# EAGLE design drownAlert_try1 (EAGLE 9.4.0)
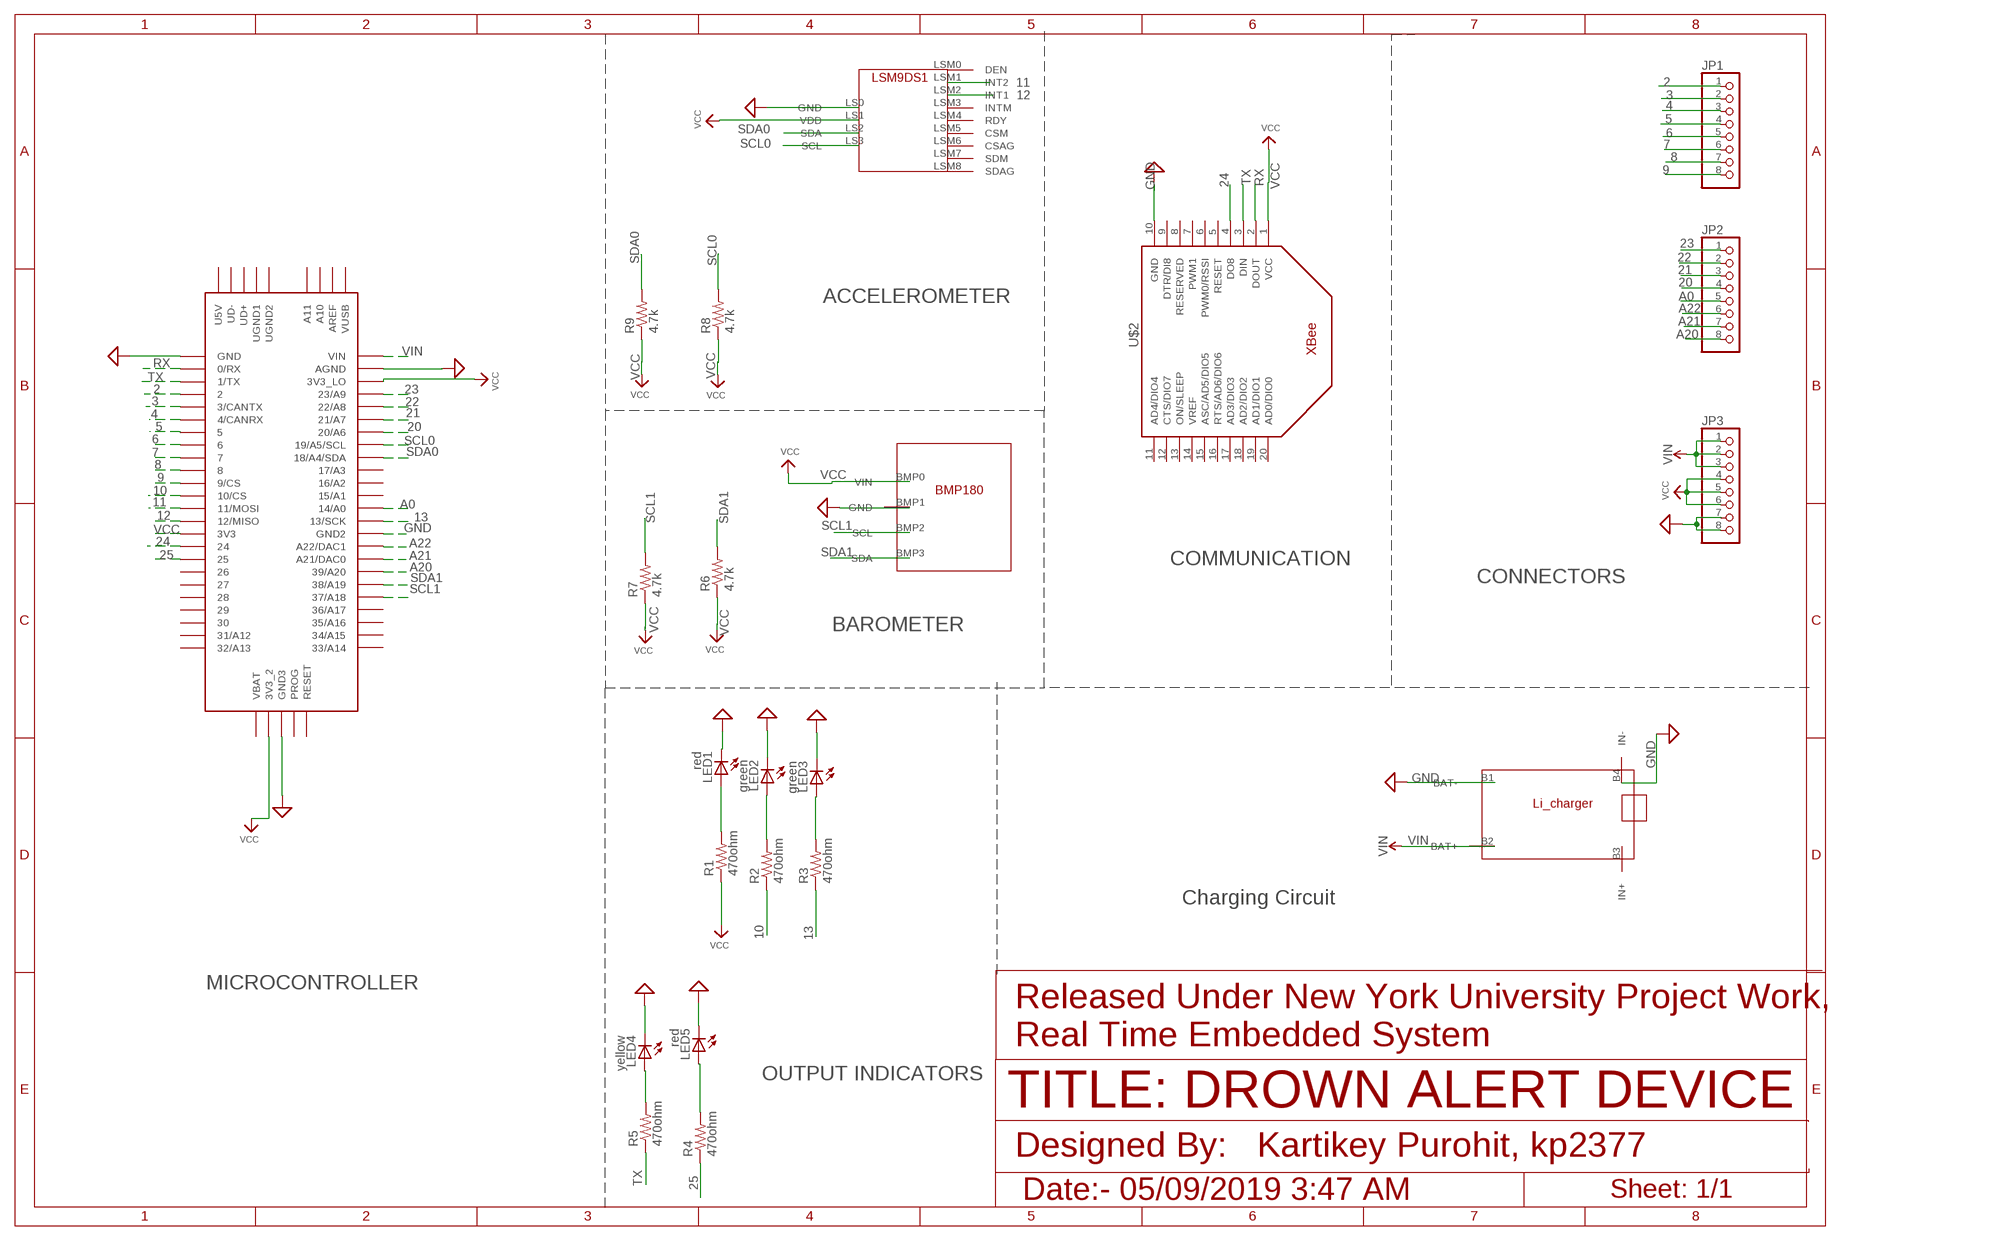
[diagram p0: schematic, sheet 1]

## Parts
JP1  PINHD-1X8-3.5MM  [1X08-3.5MM]
JP2  PINHD-1X8-3.5MM  [1X08-3.5MM]
JP3  PINHD-1X8-3.5MM  [1X08-3.5MM]
LED1  red  LEDCHIPLED_1206  [CHIPLED_1206]
LED2  green  LEDCHIPLED_1206  [CHIPLED_1206]
LED3  green  LEDCHIPLED_1206  [CHIPLED_1206]
LED4  yellow  LEDCHIPLED_1206  [CHIPLED_1206]
LED5  red  LEDCHIPLED_1206  [CHIPLED_1206]
R1  470ohm  R-US_R1206  [R1206]
R2  470ohm  R-US_R1206  [R1206]
R3  470ohm  R-US_R1206  [R1206]
R4  470ohm  R-US_R1206  [R1206]
R5  470ohm  R-US_R1206  [R1206]
R6  4.7k  R-US_R1206  [R1206]
R7  4.7k  R-US_R1206  [R1206]
R8  4.7k  R-US_R1206  [R1206]
R9  4.7k  R-US_R1206  [R1206]
U$1  TEENSY_3.5/3.6  [TEENSY_3.5/3.6]
U$2  XBEE  [XBEE]
U$3  KKP_BATTERY_CHARGER  [KKP_CUSTOM_BATTERY_CHARGER]
U$5  KKP_BMP180  [KKP_CUSTOM_BMP180]
U$6  KKP_LSM  [KKP_CUSTOM_LSM9D-S1_FOOTPRINT]

## Nets
2: JP1.1 U$1.2
3: JP1.2 U$1.3/CANTX
4: JP1.3 U$1.4/CANRX
5: JP1.4 U$1.5
6: JP1.5 U$1.6
7: JP1.6 U$1.7
8: JP1.7 U$1.8
9: JP1.8 U$1.9/CS
10: R2.1 U$1.10/CS
11: U$1.11/MOSI U$6.LSM1(INT2)
12: U$1.12/MISO U$6.LSM2(INT1)
13: R3.1 U$1.13/SCK
20: JP2.4 U$1.20/A6
21: JP2.3 U$1.21/A7
22: JP2.2 U$1.22/A8
23: JP2.1 U$1.23/A9
24: U$1.24 U$2.4(DO8)
25: R4.1 U$1.25
A0: JP2.5 U$1.14/A0
A20: JP2.8 U$1.39/A20
A21: JP2.7 U$1.21/DAC0(A21/DAC0)
A22: JP2.6 U$1.A22/DAC1
GND: JP3.7 JP3.8 LED1.C LED2.C LED3.C LED4.C LED5.C U$1.AGND U$1.GND U$1.GND2 U$1.GND3 U$2.10(GND) U$3.B1(BAT-) U$3.B4(IN-) U$5.BMP1(GND) U$6.LS0(GND) ; supply symbol labelled SUP
N$1: LED1.A R1.2
N$2: LED2.A R2.2
N$3: LED3.A R3.2
N$32: LED4.A R5.2
N$33: LED5.A R4.2
RX: U$1.0/RX U$2.2(DOUT)
SCL0: R8.2 U$1.19/A5/SCL U$6.LS3(SCL)
SCL1: R7.2 U$1.37/A18 U$5.BMP2(SCL)
SDA0: R9.2 U$1.18/A4/SDA U$6.LS2(SDA)
SDA1: R6.2 U$1.38/A19 U$5.BMP3(SDA)
TX: R5.1 U$1.1/TX U$2.3(DIN)
VCC: JP3.4 JP3.5 JP3.6 R1.1 R6.1 R7.1 R8.1 R9.1 U$1.3V3 U$1.3V3_2 U$1.3V3_LO U$2.1(VCC) U$5.BMP0(VIN) U$6.LS1(VDD)
VIN: JP3.1 JP3.2 JP3.3 U$1.VIN U$3.B2(BAT+)
Unconnected: U$1.15/A1 U$1.16/A2 U$1.17/A3 U$1.26 U$1.27 U$1.28 U$1.29 U$1.30 U$1.31/A12 U$1.32/A13 U$1.33/A14 U$1.34/A15 U$1.35/A16 U$1.36/A17 U$1.A10 U$1.A11 U$1.AREF U$1.PROG U$1.RESET U$1.U5V U$1.UD+ U$1.UD- U$1.UGND1 U$1.UGND2 U$1.VBAT U$1.VUSB U$2.5(RESET) U$2.6(PWM0/RSSI) U$2.7(PWM1) U$2.8(RESERVED) U$2.9(DTR/DI8) U$2.11(AD4/DIO4) U$2.12(CTS/DIO7) U$2.13(ON/SLEEP) U$2.14(VREF) U$2.15(ASC/AD5/DIO5) U$2.16(RTS/AD6/DIO6) U$2.17(AD3/DIO3) U$2.18(AD2/DIO2) U$2.19(AD1/DIO1) U$2.20(AD0/DIO0) U$3.B3(IN+) U$6.LSM0(DEN) U$6.LSM3(INTM) U$6.LSM4(RDY) U$6.LSM5(CSM) U$6.LSM6(CSAG) U$6.LSM7(SDM) U$6.LSM8(SDAG)

## Notes on the sheet
- ACCELEROMETER
- COMMUNICATION
- CONNECTORS
- BAROMETER
- Charging Circuit
- MICROCONTROLLER
- Released Under New York University Project Work, 
  Real Time Embedded System
- OUTPUT INDICATORS
- TITLE: DROWN ALERT DEVICE
- Designed By:   Kartikey Purohit, kp2377
- Date:- 05/09/2019 3:47 AM | Sheet: 1/1

## Library data of the parts
JP1-JP3 = adafruit:PINHD-1X8: PIN HEADER
LED1-LED5 = adafruit:LED: LED OSRAM: - CHIPLED LG R971, LG N971, LY N971, LG Q971, LY Q971, LO R971, LY R971 LH N974, LH R974 LS Q976, LO Q976, LY Q976 LO Q996 - Hyper CHIPLED LW Q18S LB Q993, LB Q99A, LB R99A - SideLED LS A670, LO A670, LY A670, LG A670, LP A670 LB A673, LV A673, LT A673, LW A673 LH A674 LY A675 LS A676, LA A676, LO A676, LY A676, LW A676 LS A679, LY A679, LG A679 - Hyper Micro SIDELED® LS Y876, LA Y876, LO Y876, LY Y876 LT Y87S - SmartLED LW L88C, LW L88S LB L89C, LB L89S, LG L890 LS L89K, LO L89K, LY L89K LS L896, LA L896, LO L896, LY L896 - TOPLED LS T670, LO T670, LY T670, LG T670, LP T670 LSG T670, LSP T670, LSY T670, LOP T670, LYG T670 LG T671, LOG T671, LSG T671 LB T673, LV T673, LT T673, LW T673 LH T674 LS T676, LA T676, LO T676, LY T676, LB T676, LH T676, LSB T676, LW T676 LB T67C, LV T67C, LT T67C, LS T67K, LO T67K, LY T67K, LW E67C LS E67B, LA E67B, LO E67B, LY E67B, LB E67C, LV E67C, LT E67C LW T67C LS T679, LY T679, LG T679 LS T770, LO T770, LY T770, LG T770, LP T770 LB T773, LV T773, LT T773, LW T773 LH T774 LS E675, LA E675, LY E675, LS T675 LS T776, LA T776, LO T776, LY T776, LB T776 LHGB T686 LT T68C, LB T68C - Hyper Mini TOPLED® LB M676 - Mini TOPLED Santana® LG M470 LS M47K, LO M47K, LY M47K Source: http://www.osram.convergy.de/
R1-R9 = adafruit:R-US_: RESISTOR, American symbol
U$1 = Teensy356:TEENSY_3.5/3.6
U$2 = adafruit:XBEE
U$3 = kkp_lsm:KKP_BATTERY_CHARGER
U$5 = kkp_lsm:KKP_BMP180
U$6 = kkp_lsm:KKP_LSM

## Board
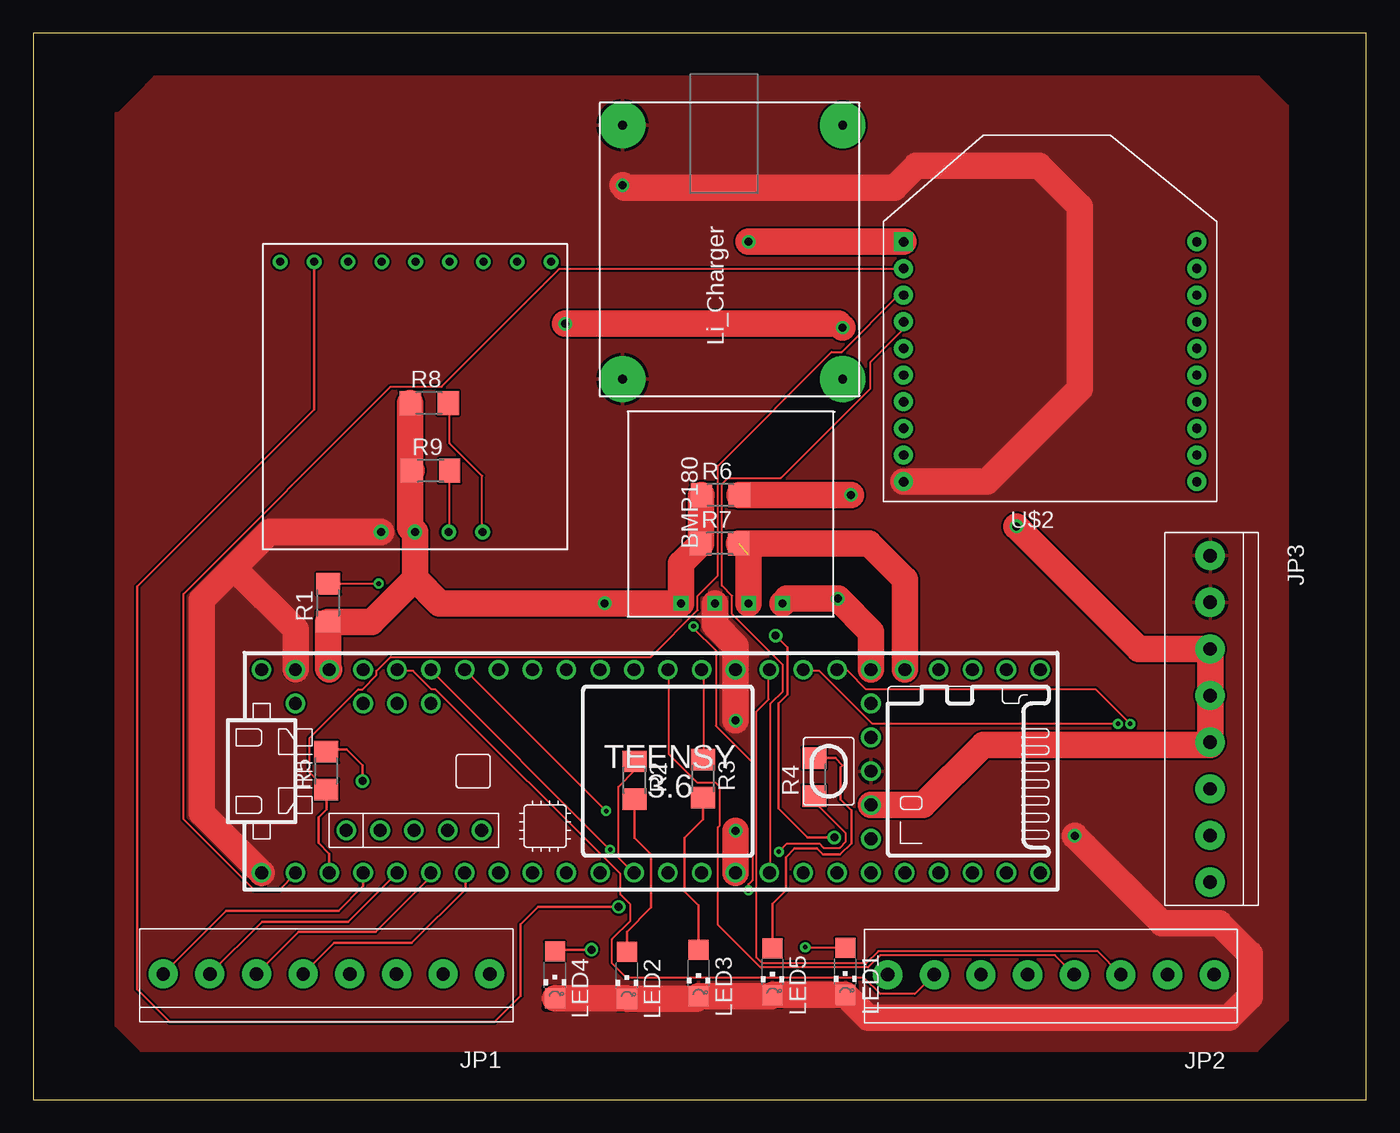
[diagram p1: board, top side]
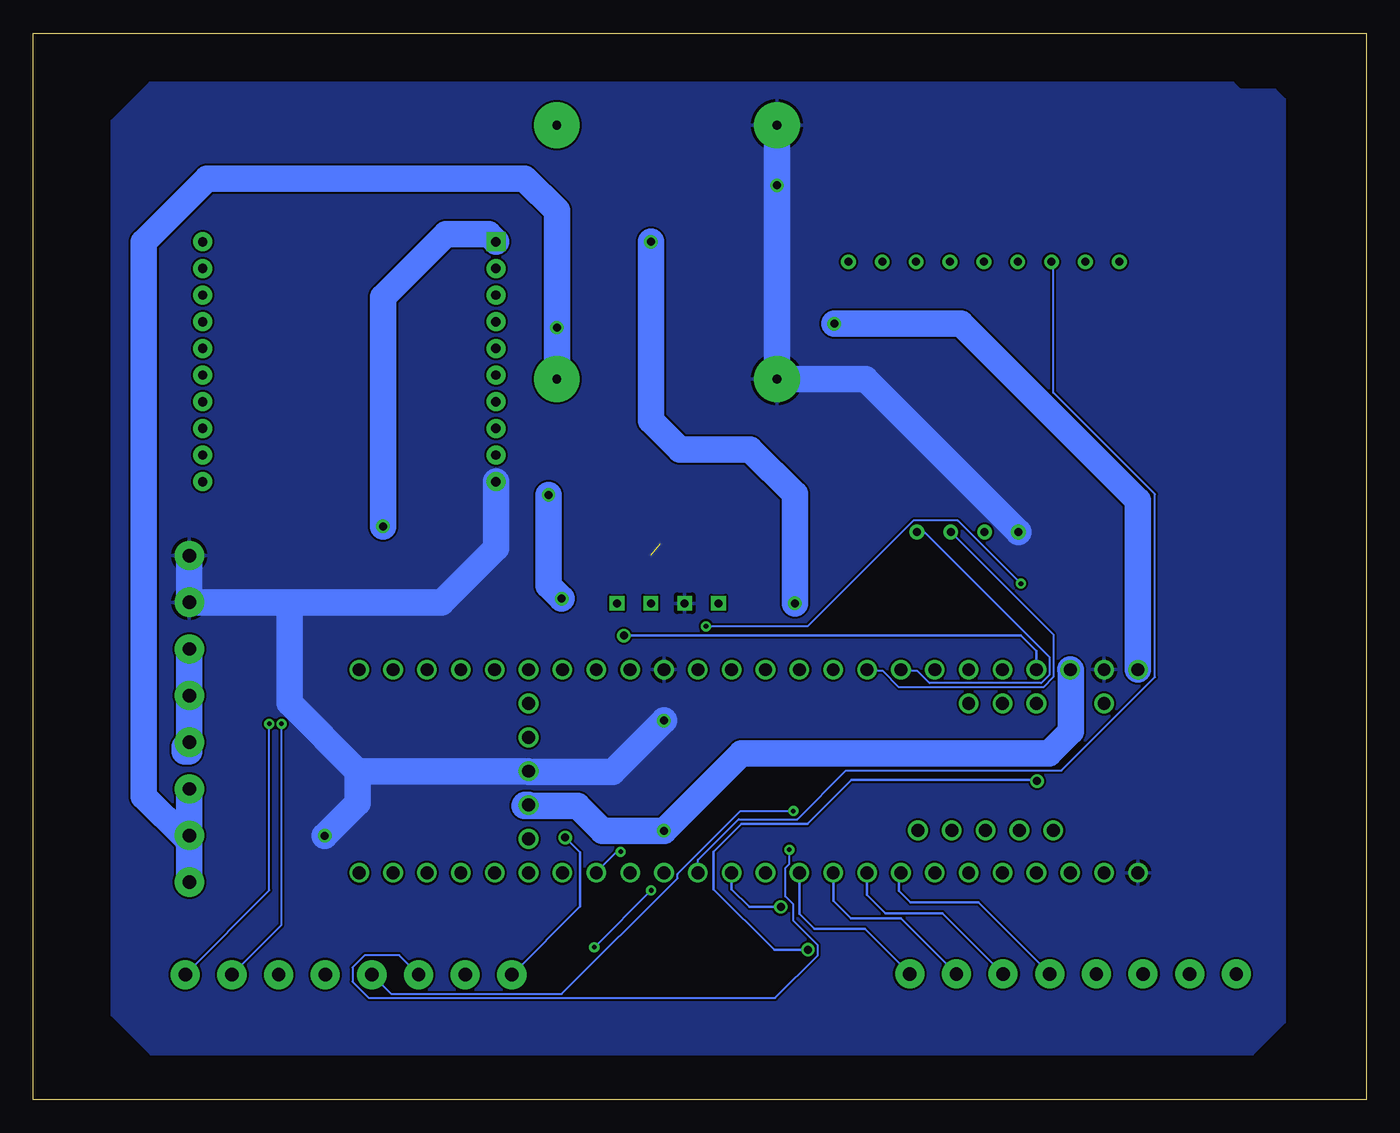
[diagram p2: board, bottom side, seen from below]

Size 100 x 80 mm. Coordinates in mm from the lower left corner, seen from the top.
Outline: 0,0 100,0 100,80 0,80 0,0
Copper layers (1*16): Top 0.035mm / dielectric 1.5mm / Bottom 0.035mm
Design rules "default": minimum track width 6mil, minimum drill 0.35mm, track to track 6mil, track to pad 6mil, pad to pad 6mil, via to via 6mil, smd to smd 6mil, copper to edge 40mil, drill to drill 6mil, minimum pad ring 10mil, minimum via ring 8mil, stop-mask expansion 4mil, vias tented up to drill 0mil, thermal gap 10mil

### Footprints (pad centres in the part's own frame; a part is rotated, then mirrored left to right if it is on the bottom)
1X08-3.5MM = drill 1 pad 2.184: 1 -12.25,0; 2 -8.75,0; 3 -5.25,0; 4 -1.75,0; 5 1.75,0; 6 5.25,0; 7 8.75,0; 8 12.25,0
CHIPLED_1206 = smd 1.5 x 1.5: A 0,-1.75; C 0,1.75
R1206 = smd 1.6 x 1.803: 1 -1.422,0; 2 1.422,0
TEENSY_3.5/3.6 = drill 0.965: 0/RX -25.4,-7.62; 1/TX -22.86,-7.62; 2 -20.32,-7.62; 3/CANTX -17.78,-7.62; 3V3 7.62,-7.62; 3V3_2 17.78,-2.54; 3V3_LO -22.86,7.62; 4/CANRX -15.24,-7.62; 5 -12.7,-7.62; 6 -10.16,-7.62; 7 -7.62,-7.62; 8 -5.08,-7.62; 9/CS -2.54,-7.62; 10/CS 0,-7.62; 11/MOSI 2.54,-7.62; 12/MISO 5.08,-7.62; 13/SCK 5.08,7.62; 14/A0 2.54,7.62; 15/A1 0,7.62; 16/A2 -2.54,7.62; 17/A3 -5.08,7.62; 18/A4/SDA -7.62,7.62; 19/A5/SCL -10.16,7.62; 20/A6 -12.7,7.62; 21/A7 -15.24,7.62; 21/DAC0 12.7,7.62; 22/A8 -17.78,7.62; 23/A9 -20.32,7.62; 24 10.16,-7.62; 25 12.7,-7.62; 26 15.24,-7.62; 27 17.78,-7.62; 28 20.32,-7.62; 29 22.86,-7.62; 30 25.4,-7.62; 31/A12 27.94,-7.62; 32/A13 30.48,-7.62; 33/A14 30.48,7.62; 34/A15 27.94,7.62; 35/A16 25.4,7.62; 36/A17 22.86,7.62; 37/A18 20.32,7.62; 38/A19 17.78,7.62; 39/A20 15.24,7.62; A10 -17.78,5.08; A11 -15.24,5.08; A22/DAC1 10.16,7.62; AGND -25.4,7.62; AREF -20.32,5.08; GND -27.94,-7.62; GND2 7.62,7.62; GND3 17.78,0; PROG 17.78,2.54; RESET 17.78,5.08; U5V -21.59,-4.445; UD+ -16.51,-4.445; UD- -19.05,-4.445; UGND1 -13.97,-4.445; UGND2 -11.43,-4.445; VBAT 17.78,-5.08; VIN -27.94,7.62; VUSB -25.4,5.08
XBEE = drill 0.7 pad 1.422 square: 1 -11,5.5 | drill 0.7 pad 1.422: 2 -11,3.5; 3 -11,1.5; 4 -11,-0.5; 5 -11,-2.5; 6 -11,-4.5; 7 -11,-6.5; 8 -11,-8.5; 9 -11,-10.5; 10 -11,-12.5; 11 11,-12.5; 12 11,-10.5; 13 11,-8.5; 14 11,-6.5; 15 11,-4.5; 16 11,-2.5; 17 11,-0.5; 18 11,1.5; 19 11,3.5; 20 11,5.5
KKP_CUSTOM_BATTERY_CHARGER = drill 0.65 pad 3.422: B1 1.27,17.78; B2 1.27,1.27; B3 20.32,1.27; B4 20.32,17.78
KKP_CUSTOM_BMP180 = drill 0.6 square: BMP0 0.98,11.46; BMP1 0.98,8.92; BMP2 0.98,6.38; BMP3 0.98,3.84
KKP_CUSTOM_LSM9D-S1_FOOTPRINT = drill 0.6: LS0 1.27,13.98; LS1 1.27,11.44; LS2 1.27,8.9; LS3 1.27,6.36; LSM0 21.55,21.54; LSM1 21.55,19; LSM2 21.55,16.46; LSM3 21.55,13.92; LSM4 21.55,11.38; LSM5 21.55,8.84; LSM6 21.55,6.3; LSM7 21.55,3.76; LSM8 21.55,1.22

### Placement (x,y rotation side)
JP1  21.99,9.42 0 top
JP2  76.35,9.37 0 top
JP3  88.29,28.56 90 top
LED1  60.92,9.62 180 top
LED2  44.53,9.32 180 top
LED3  49.91,9.48 180 top
LED4  39.13,9.36 180 top
LED5  55.46,9.58 180 top
R1  22.12,37.27 90 top
R2  45.11,23.95 270 top
R3  50.25,24.08 270 top
R4  58.6,24.2 90 top
R5  21.97,24.67 90 top
R6  51.55,45.36 0 top
R7  51.5,41.73 0 top
R8  29.7,52.26 0 top
R9  29.81,47.18 0 top
U$1  45.06,24.63 0 top
U$2  76.29,58.85 0 top
U$3  61.99,52.79 90 top
U$5  60.05,36.25 90 top
U$6  40.07,41.3 90 top

### Tracks (layer width: path | path; a pad name or v marks a point on that pad's centre or on a via)
2
  Top 0.2: JP1.1 14.49,14.16 22.89,14.16 24.75,16.01 U$1.2
3
  Top 0.2: JP1.2 17.16,13.33 23.61,13.33 U$1.3/CANTX
4
  Top 0.2: JP1.3 19.91,12.59 25.67,12.59 29.82,16.75 U$1.4/CANRX
5
  Top 0.2: U$1.5 32.41,16.96 32.41,15.78 28.4,11.76 22.59,11.76 JP1.4
6
  Bottom 0.2: JP1.5 29.11,14.78 34.19,14.78 35.06,15.65 35.06,16.86 U$1.6
7
  Bottom 0.2: JP1.6 31.78,13.96 36.06,13.96 37.45,15.34 U$1.7
8
  Bottom 0.2: U$1.8 39.98,14.9 38.66,13.58 34.91,13.58 JP1.7
9
  Bottom 0.2: JP1.8 37.62,12.8 41.4,12.8 42.52,13.92 U$1.9/CS
10
  Top 0.152: R2.1 45.11,25.3 45.11,24.69 43.89,23.47 43.89,18.14 44.96,17.07 U$1.10/CS
11  (via drill 0.6)
  Top 0.2: U$6.LSM1 21.07,51.77 7.78,38.48 7.78,8.28 10.23,5.84 34.61,5.84 36.55,7.79 36.55,13.13 37.88,14.46 v43.92,14.46
  Bottom 0.2: v43.92,14.46 46.28,14.46 47.61,15.78 U$1.11/MOSI
12
  Bottom 0.152: U$6.LSM2 23.47,62.79 23.47,53.03 15.85,45.41 15.85,31.7 22.86,24.69 39.01,24.69 42.67,21.03 47.09,21.03 50.14,17.98 50.14,17.07 U$1.12/MISO
13
  Top 0.152: R3.1 50.29,25.6 50.29,32.16 U$1.13/SCK
20  (via drill 0.35)
  Top 0.152: v42.98,21.64 32.46,32.16 U$1.20/A6
  Bottom 0.152: v42.98,21.64 46.94,21.64 51.66,16.92 51.66,16.61 60.35,7.92 73.15,7.92 74.52,9.3 JP2.4
21  (via drill 0.35)
  Top 0.152: v43.28,18.75 29.87,32.16 U$1.21/A7
  Bottom 0.152: v43.28,18.75 43.28,17.68 43.59,17.37 43.59,15.24 42.98,14.63 42.98,13.41 41.15,11.58 41.15,10.82 44.35,7.62 74.83,7.62 76.05,8.84 76.05,9.91 75.13,10.82 72.54,10.82 71.17,9.45 JP2.3
22
  Top 0.152: U$1.22/A8 27.43,32.16 28.5,32.16 29.87,30.79 30.18,30.79 44.04,16.92 44.04,15.39 44.81,14.63 44.81,13.41 43.43,12.04 43.43,10.21 44.5,9.14 62.33,9.14 63.55,7.92 66.14,7.92 67.51,9.3 JP2.2
23  (via drill 0.6)
  Top 0.2: v60.09,19.66 58.08,19.66 55.9,21.85 55.9,29.71 56.59,30.4 56.59,33.91 v55.69,34.81
  Bottom 0.2: JP2.1 58.99,14.48 58.99,18.56 v60.09,19.66 | v55.69,34.81 25.91,34.81 24.75,33.65 U$1.23/A9
24
  Top 0.152: U$2.4 65.23,58.22 65.23,57.76 62.79,55.32 62.79,53.34 56.08,46.63 52.12,46.63 51.66,46.18 51.66,38.56 52.43,37.8 52.43,36.42 56.24,32.61 56.24,30.63 55.32,29.72 55.32,17.07 U$1.24
25  (via drill 0.35)
  Top 0.152: v55.93,18.59 56.54,19.2 58.98,19.2 59.28,18.9 60.5,18.9 60.96,19.36 60.96,19.96 58.67,22.25 58.67,22.71 R4.1
  Bottom 0.152: v55.93,18.59 56.24,18.59 57.76,17.07 U$1.25
A0
  Top 0.152: U$1.14/A0 47.7,32.16 47.7,25.91 49.84,23.77 51.21,23.77 51.51,23.47 51.51,20.57 51.36,20.42 51.36,13.11 54.56,9.91 62.64,9.91 63.55,10.82 76.66,10.82 78.03,9.45 JP2.5
A20  (via drill 0.35)
  Top 0.152: v82.3,28.19 79.7,30.79 62.48,30.79 61.11,32.16 60.35,32.16 U$1.39/A20
  Bottom 0.152: v82.3,28.19 82.3,15.7 88.54,9.45 JP2.8
A21  (via drill 0.35)
  Top 0.152: v81.38,28.19 62.94,28.19 58.98,32.16 57.91,32.16 U$1.21/DAC0
  Bottom 0.152: v81.38,28.19 81.38,13.11 85.04,9.45 JP2.7
A22
  Top 0.152: U$1.A22/DAC1 55.17,32.16 55.17,30.02 54.25,29.11 54.25,10.67 54.71,10.21 62.48,10.21 63.4,11.12 79.86,11.12 81.53,9.45 JP2.6
GND  (via drill 0.6)
  Top 2: LED4.C 44.5,7.61 LED2.C 49.75,7.57 LED3.C 55.36,7.73 LED5.C 55.5,7.87 LED1.C 62.67,6.12 89.71,6.12 91.28,7.7 91.28,10.93 88.98,13.23 84.69,13.23 v78.13,19.8 | U$6.LS0 17.72,42.57 15.04,39.89 | U$1.GND 12.63,21.5 12.63,37.48 15.04,39.89 | U$5.BMP1 51.13,35.6 52.69,34.05 U$1.GND2 v52.69,28.44 | U$1.AGND 19.66,35.26 15.04,39.89 | U$2.10 71.55,46.35 78.53,53.33 78.53,66.99 75.46,70.06 66.24,70.06 64.62,68.44 44.37,68.44 v44.21,68.6
  Bottom 2: U$6.LS0 37.57,54.06 U$3.B1 v44.21,68.6 U$3.B4 | JP3.8 JP3.7 80.78,37.31 | U$2.10 65.29,41.4 69.38,37.31 80.78,37.31 | 75.65,24.63 U$1.GND3 62.79,24.58 56.54,24.58 v52.69,28.44 | 80.78,37.31 80.78,29.76 75.65,24.63 | v78.13,19.8 75.65,22.27 75.65,24.63
  pour Top: 8.45,76.09 6.37,74.01 6.17,74.01 6.17,5.53 8.06,3.64 8.36,3.64 91.82,3.64 94.11,5.93 94.11,74.58 91.96,76.74 9.07,76.74 8.48,76.15
  pour Bottom: 9.43,75.77 6.83,75.77 6.11,75.06 6.11,5.79 8.52,3.38 91.19,3.38 94.12,6.31 94.12,73.44 91.27,76.29 9.97,76.29 9.49,75.81
N$1  (via drill 0.35)
  Top 0.152: v57.91,11.43 60.81,11.43 LED1.A | v53.65,15.7 53.65,16.15 53.95,16.46 53.95,25.3 51.21,28.04 51.21,33.68 49.53,35.36 v49.53,35.51 | v25.91,38.71 22.25,38.71 R1.2
  Bottom 0.152: v53.65,15.7 v57.91,11.43 | v49.53,35.51 41.91,35.51 33.98,43.43 30.63,43.43 v25.91,38.71
N$2
  Top 0.2: R2.2 45.11,19.64 46.35,18.4 46.35,14.42 44.53,12.6 LED2.A
N$3
  Top 0.2: LED3.A 49.91,14.57 48.87,15.61 48.87,19.65 50.25,21.04 R3.2
N$32  (via drill 0.6)
  Top 0.2: LED4.A 39.26,11.24 v41.88,11.24 | v24.69,23.89 24.69,25.07 23.51,26.25 22.13,26.25 R5.2
  Bottom 0.2: v41.88,11.24 44.41,11.24 48.95,15.79 48.95,18.57 46.85,20.67 41.91,20.67 38.6,23.98 24.78,23.98 v24.69,23.89
N$33
  Top 0.2: LED5.A 55.46,14.7 56.45,15.69 56.45,18.17 57.12,18.83 58.81,18.83 59.26,18.39 60.52,18.39 61.37,19.24 61.37,21.71 60.56,22.51 60.56,24.93 60.71,25.07 60.16,25.62 R4.2
RX
  Top 0.152: U$2.2 65.23,62.33 39.47,62.33 30.63,53.49 26.82,53.49 11.28,37.95 11.28,21.03 16.61,15.7 18.44,15.7 19.66,16.92 U$1.0/RX
SCL0
  Top 0.152: R8.2 31.24,52.12 31.24,49.23 33.68,46.79 33.68,42.67 U$6.LS3
  Bottom 0.152: U$1.19/A5/SCL 34.9,32.16 33.68,32.16 32.77,31.24 24.38,31.24 23.77,31.85 23.77,33.22 33.07,42.52 33.68,42.52 U$6.LS3
SCL1  (1 unrouted)
  Top 0.152: 53.65,40.84 53.67,40.84
  Top 2: U$5.BMP2 53.67,39.75 | 53.67,39.75 53.67,40.84 | R7.2 62.69,41.73 65.4,39.02 65.4,32.27 U$1.37/A18 | 53.67,39.75
SDA0
  Top 0.152: R9.2 31.24,47.09 31.24,42.67 U$6.LS2
  Bottom 0.152: U$1.18/A4/SDA 37.34,32.16 36.27,32.16 35.05,30.94 24.23,30.94 23.47,31.7 23.47,34.9 31.09,42.52 U$6.LS2
SDA1  (via drill 0.6)
  Top 2: U$1.38/A19 62.84,35.1 v60.36,37.59 56.56,37.59 U$5.BMP3 | R6.2 v61.34,45.36
  Bottom 2: v61.34,45.36 61.34,38.57 v60.36,37.59
TX
  Top 0.152: U$2.3 65.23,60.35 64.92,60.35 60.66,56.08 59.89,56.08 51.36,47.55 51.36,39.32 49.84,37.8 49.84,36.73 46.33,33.22 26.82,33.22 25.76,32.16 25.76,31.85 24.69,30.79 24.38,30.79 20.73,27.13 20.73,24.54 21.95,23.32 R5.1
  Top 0.2: U$1.1/TX 22.2,18.45 21.41,19.24 21.41,21.18 21.99,21.75 21.99,23.23 R5.1
VCC  (via drill 0.6)
  Top 2: U$1.3V3_LO 22.12,32.33 R1.1 25.38,35.85 28.63,39.1 | JP3.6 88.29,26.62 88.1,26.62 | U$1.3V3_2 66.75,22.09 71.28,26.62 88.1,26.62 | 88.1,26.62 JP3.4 JP3.6 | U$1.3V3 v52.69,20.17 | 28.63,39.1 U$6.LS1 28.28,42.92 28.28,47.29 | R9.1 28.28,47.29 | 28.28,47.29 R8.1 | R6.1 50.08,45.31 R7.1 48.59,40.23 U$5.BMP0 v42.87,37.23 30.5,37.23 28.63,39.1 | JP3.6 82.96,33.81 v73.77,43 | U$2.1 v53.67,64.35
  Bottom 2: U$1.3V3_2 63.09,22.09 63.14,22.04 59.17,22.04 57.3,20.17 v52.69,20.17 46.87,25.98 23.8,25.98 22.17,27.61 22.17,32.22 U$1.3V3_LO | v73.77,43 73.77,60.19 69.04,64.92 65.85,64.92 U$2.1 | v53.67,64.35 53.67,50.94 51.49,48.77 46.21,48.77 42.87,45.43 v42.87,37.23 | JP3.4 88.29,26.14 88.63,26.14 88.63,26.47 JP3.4 | JP3.6 JP3.5 JP3.4
VIN  (via drill 0.6)
  Top 2: v39.9,58.22 60.42,58.22 v60.72,57.92
  Bottom 0.152: JP3.2 88.39,19.81 88.58,19.62
  Bottom 2: JP3.3 JP3.2 88.29,19.34 | 88.29,19.34 JP3.1 | U$3.B2 v60.72,57.92 60.72,66.68 63.13,69.1 86.95,69.1 91.7,64.35 91.7,22.75 88.58,19.62 88.29,19.34 | U$1.VIN 17.12,44.93 30.41,58.22 v39.9,58.22